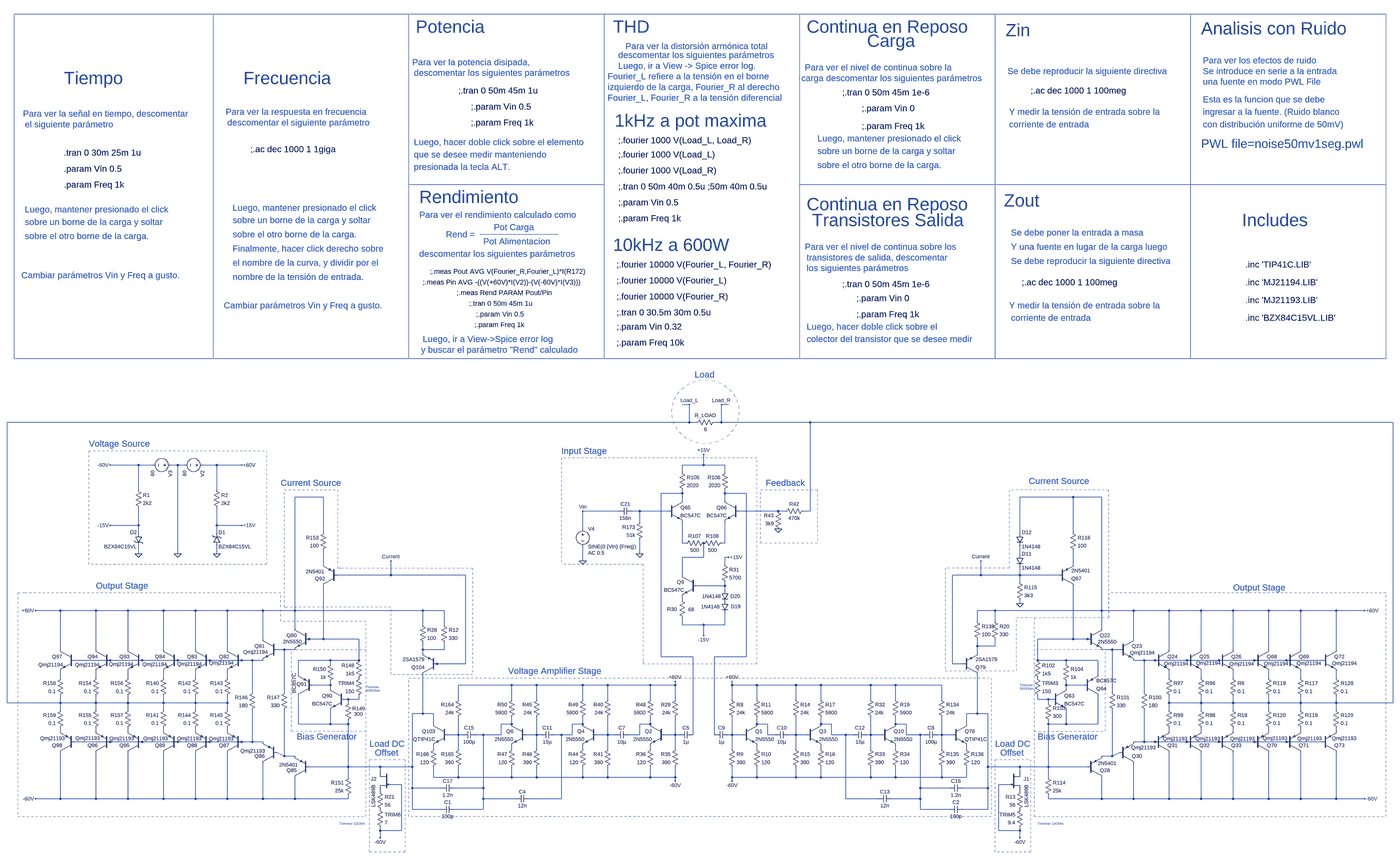
[diagram p0: schematic V12.asc, whole sheet]
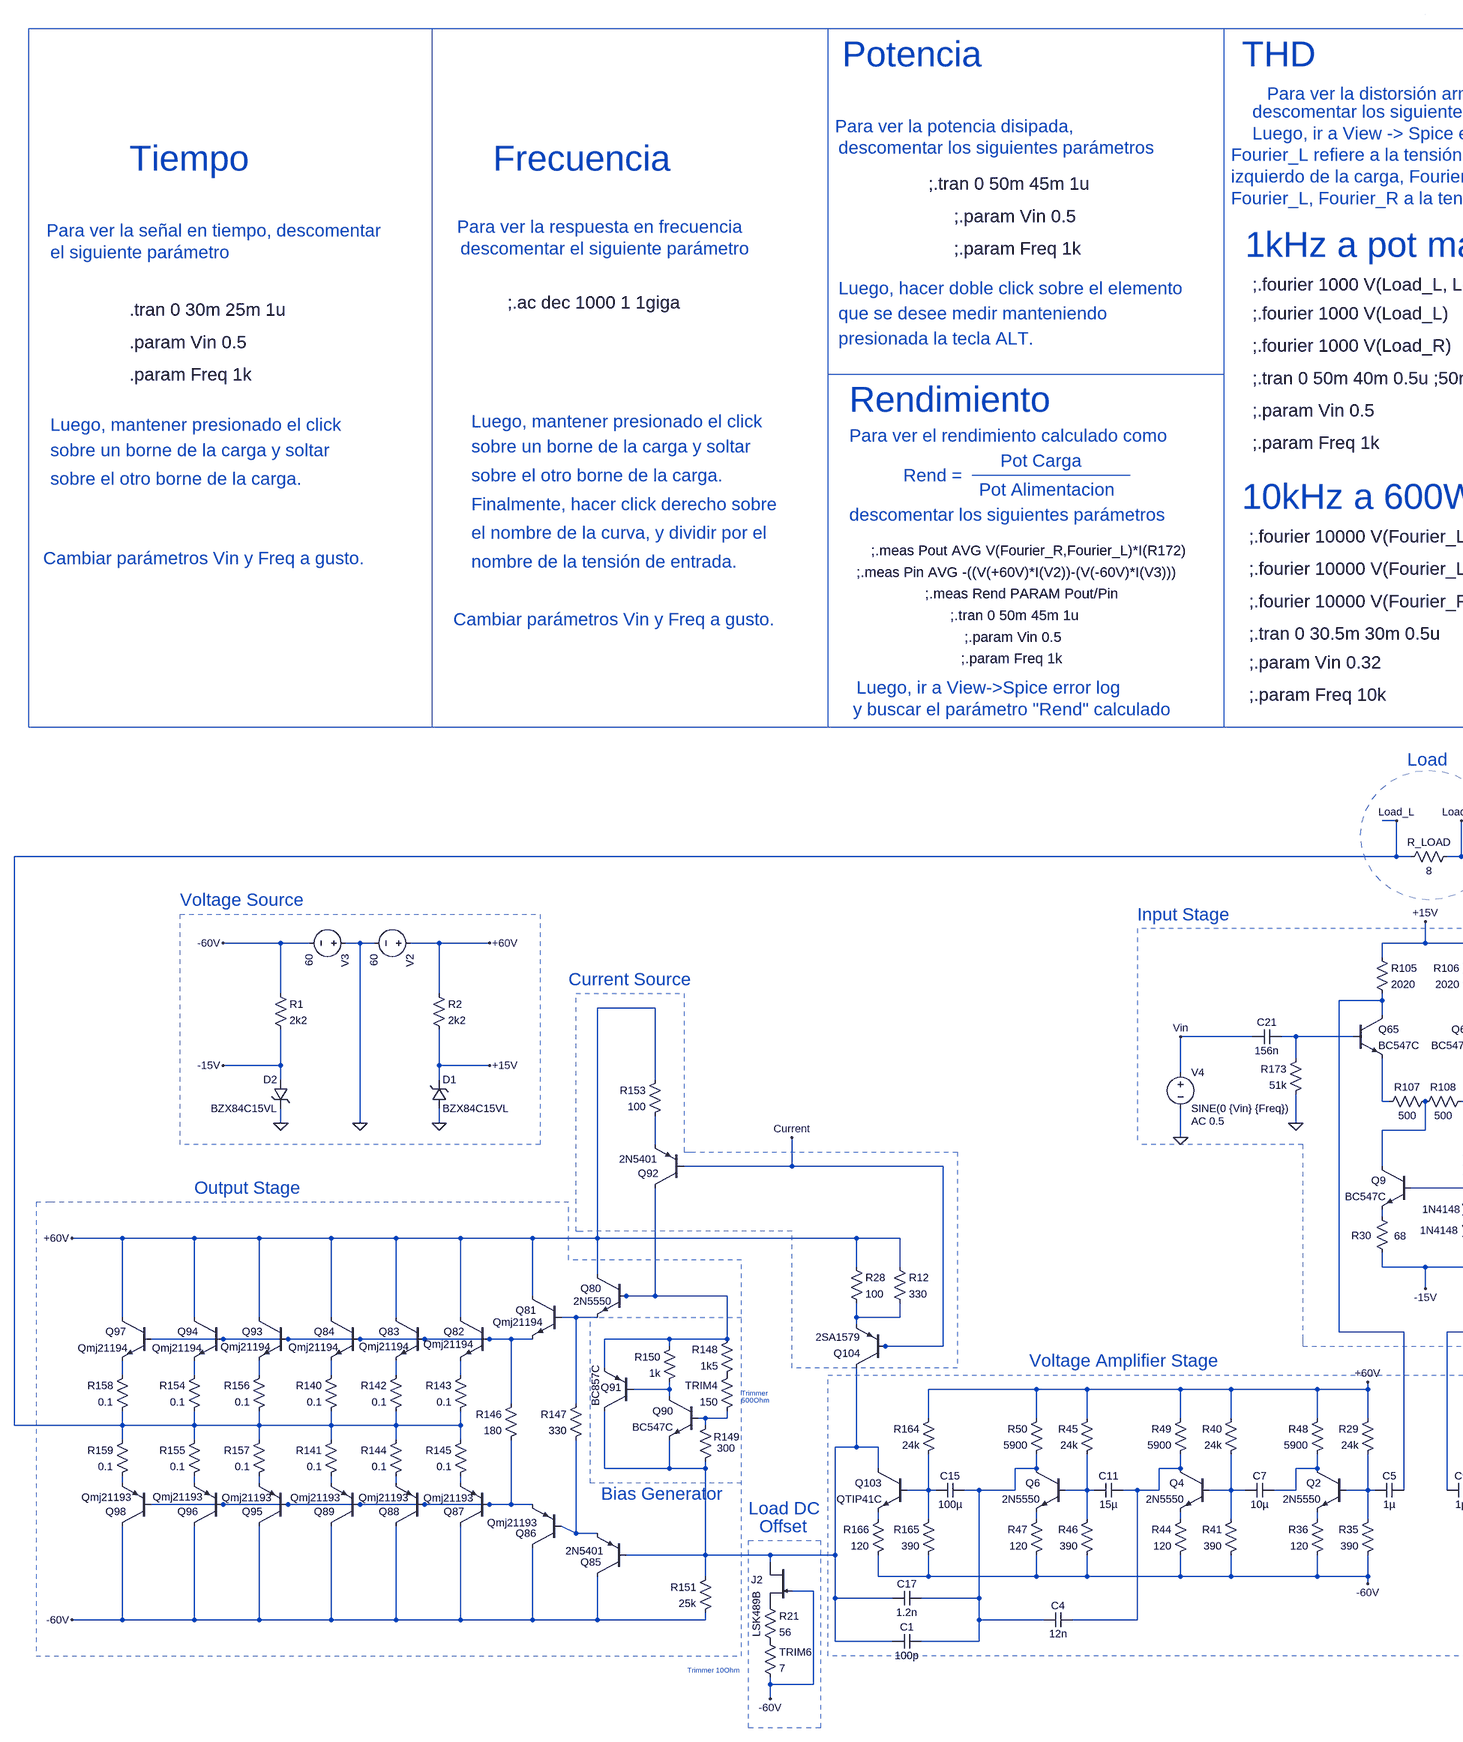
[diagram p1: schematic V12.asc, part, row 1 of 1, column 1 of 2]
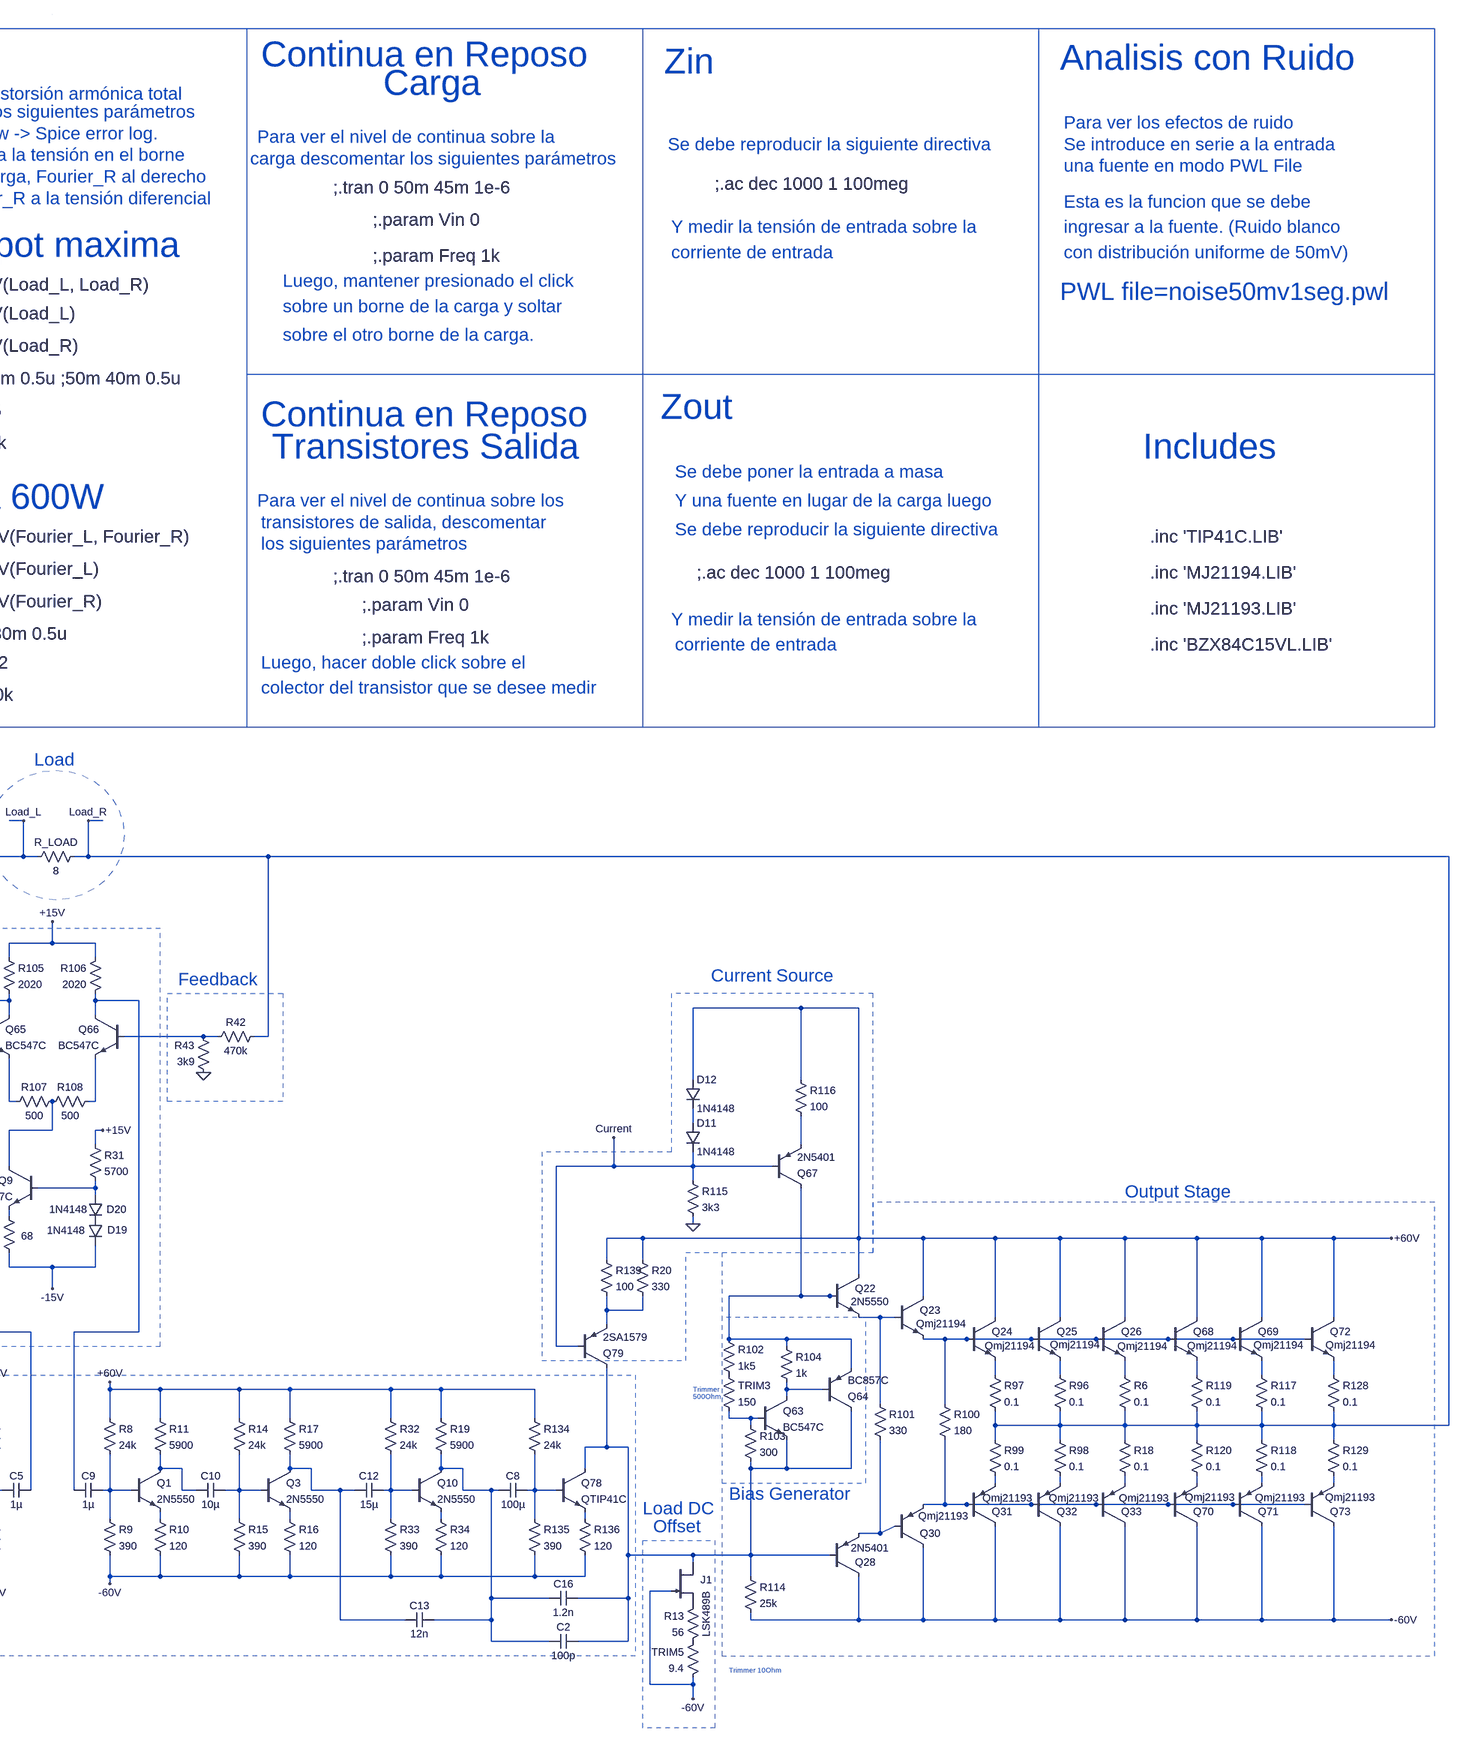
[diagram p2: schematic V12.asc, part, row 1 of 1, column 2 of 2]
V12.asc, the LTspice schematic file:
Version 4
SHEET 1 16980 7664
WIRE 7696 4128 7664 4128
WIRE 7872 4128 7840 4128
WIRE 7696 4208 7696 4128
WIRE 7696 4208 4624 4208
WIRE 7728 4208 7696 4208
WIRE 7840 4208 7840 4128
WIRE 7840 4208 7808 4208
WIRE 8240 4208 7840 4208
WIRE 10864 4208 8240 4208
WIRE 5216 4400 5088 4400
WIRE 5280 4400 5216 4400
WIRE 5392 4400 5360 4400
WIRE 5424 4400 5392 4400
WIRE 5568 4400 5504 4400
WIRE 5680 4400 5568 4400
WIRE 7760 4400 7760 4352
WIRE 7760 4400 7664 4400
WIRE 7856 4400 7760 4400
WIRE 7664 4432 7664 4400
WIRE 7856 4432 7856 4400
WIRE 5216 4512 5216 4400
WIRE 5568 4512 5568 4400
WIRE 7664 4528 7664 4512
WIRE 7664 4528 7568 4528
WIRE 7856 4528 7856 4512
WIRE 7952 4528 7856 4528
WIRE 6048 4544 5920 4544
WIRE 9424 4544 9184 4544
WIRE 9552 4544 9424 4544
WIRE 7664 4560 7664 4528
WIRE 7856 4560 7856 4528
WIRE 7376 4608 7216 4608
WIRE 7472 4608 7440 4608
WIRE 7600 4608 7472 4608
WIRE 8096 4608 7920 4608
WIRE 8128 4608 8096 4608
WIRE 8240 4608 8240 4208
WIRE 8240 4608 8208 4608
WIRE 7472 4656 7472 4608
WIRE 5216 4672 5216 4592
WIRE 5216 4672 5088 4672
WIRE 5568 4672 5568 4592
WIRE 5680 4672 5568 4672
WIRE 7216 4688 7216 4608
WIRE 5216 4704 5216 4672
WIRE 5568 4704 5568 4672
WIRE 6048 4704 6048 4544
WIRE 9184 4704 9184 4544
WIRE 9424 4704 9424 4544
WIRE 7664 4752 7664 4656
WIRE 7680 4752 7664 4752
WIRE 7856 4752 7856 4656
WIRE 7856 4752 7840 4752
WIRE 5216 4800 5216 4768
WIRE 5392 4800 5392 4400
WIRE 5568 4800 5568 4768
WIRE 7472 4800 7472 4736
WIRE 9184 4800 9184 4768
WIRE 7760 4816 7760 4752
WIRE 7760 4816 7664 4816
WIRE 7872 4816 7856 4816
WIRE 7216 4832 7216 4768
WIRE 6048 4848 6048 4784
WIRE 7856 4848 7856 4816
WIRE 9424 4848 9424 4784
WIRE 6352 4896 6352 4832
WIRE 6352 4896 6112 4896
WIRE 6688 4896 6352 4896
WIRE 7664 4896 7664 4816
WIRE 9008 4896 9008 4832
WIRE 9008 4896 8880 4896
WIRE 9184 4896 9184 4864
WIRE 9184 4896 9008 4896
WIRE 9360 4896 9184 4896
WIRE 9184 4928 9184 4896
WIRE 7856 4944 7856 4928
WIRE 7856 4944 7728 4944
WIRE 7856 4960 7856 4944
WIRE 7664 5008 7664 4992
WIRE 7856 5024 7856 5008
WIRE 9184 5024 9184 5008
WIRE 4864 5056 4752 5056
WIRE 5024 5056 4864 5056
WIRE 5168 5056 5024 5056
WIRE 5328 5056 5168 5056
WIRE 5472 5056 5328 5056
WIRE 5616 5056 5472 5056
WIRE 5776 5056 5616 5056
WIRE 5920 5056 5920 4544
WIRE 5920 5056 5776 5056
WIRE 6496 5056 5920 5056
WIRE 6592 5056 6496 5056
WIRE 9072 5056 8992 5056
WIRE 9552 5056 9552 4544
WIRE 9552 5056 9072 5056
WIRE 9696 5056 9552 5056
WIRE 9856 5056 9696 5056
WIRE 10000 5056 9856 5056
WIRE 10144 5056 10000 5056
WIRE 10304 5056 10144 5056
WIRE 10448 5056 10304 5056
WIRE 10608 5056 10448 5056
WIRE 10736 5056 10608 5056
WIRE 8992 5104 8992 5056
WIRE 9072 5104 9072 5056
WIRE 6496 5120 6496 5056
WIRE 6592 5120 6592 5056
WIRE 7664 5120 7664 5088
WIRE 7760 5120 7664 5120
WIRE 7856 5120 7856 5072
WIRE 7856 5120 7760 5120
WIRE 5920 5136 5920 5056
WIRE 9552 5136 9552 5056
WIRE 7760 5168 7760 5120
WIRE 5776 5184 5776 5056
WIRE 5984 5184 5968 5184
WIRE 6048 5184 6048 4944
WIRE 6048 5184 5984 5184
WIRE 6208 5184 6048 5184
WIRE 9424 5184 9424 4944
WIRE 9424 5184 9264 5184
WIRE 9488 5184 9424 5184
WIRE 9504 5184 9488 5184
WIRE 9696 5184 9696 5056
WIRE 8992 5216 8992 5184
WIRE 9072 5216 9072 5184
WIRE 9072 5216 8992 5216
WIRE 4864 5232 4864 5056
WIRE 5024 5232 5024 5056
WIRE 5168 5232 5168 5056
WIRE 5328 5232 5328 5056
WIRE 5472 5232 5472 5056
WIRE 5616 5232 5616 5056
WIRE 5872 5232 5840 5232
WIRE 5920 5232 5872 5232
WIRE 6496 5232 6496 5200
WIRE 6592 5232 6592 5200
WIRE 6592 5232 6496 5232
WIRE 9600 5232 9552 5232
WIRE 9632 5232 9600 5232
WIRE 9856 5232 9856 5056
WIRE 10000 5232 10000 5056
WIRE 10144 5232 10144 5056
WIRE 10304 5232 10304 5056
WIRE 10448 5232 10448 5056
WIRE 10608 5232 10608 5056
WIRE 6496 5248 6496 5232
WIRE 8992 5248 8992 5216
WIRE 7568 5264 7568 4528
WIRE 7712 5264 7568 5264
WIRE 7952 5264 7952 4528
WIRE 7952 5264 7808 5264
WIRE 5088 5280 4928 5280
WIRE 5232 5280 5088 5280
WIRE 5392 5280 5232 5280
WIRE 5536 5280 5392 5280
WIRE 5680 5280 5536 5280
WIRE 5728 5280 5680 5280
WIRE 5776 5280 5728 5280
WIRE 6080 5280 5936 5280
WIRE 6208 5280 6208 5184
WIRE 6208 5280 6080 5280
WIRE 9264 5280 9264 5184
WIRE 9392 5280 9264 5280
WIRE 9536 5280 9392 5280
WIRE 9744 5280 9696 5280
WIRE 9792 5280 9744 5280
WIRE 9936 5280 9792 5280
WIRE 10080 5280 9936 5280
WIRE 10240 5280 10080 5280
WIRE 10384 5280 10240 5280
WIRE 10544 5280 10384 5280
WIRE 6080 5296 6080 5280
WIRE 6560 5296 6544 5296
WIRE 6688 5296 6688 4896
WIRE 6688 5296 6560 5296
WIRE 8880 5296 8880 4896
WIRE 8928 5296 8880 5296
WIRE 9392 5296 9392 5280
WIRE 5936 5344 5936 5280
WIRE 9536 5344 9536 5280
WIRE 4864 5360 4864 5328
WIRE 5024 5360 5024 5328
WIRE 5168 5360 5168 5328
WIRE 5328 5360 5328 5328
WIRE 5472 5360 5472 5328
WIRE 5616 5360 5616 5328
WIRE 9856 5360 9856 5328
WIRE 10000 5360 10000 5328
WIRE 10144 5360 10144 5328
WIRE 10304 5360 10304 5328
WIRE 10448 5360 10448 5328
WIRE 10608 5360 10608 5328
WIRE 6080 5392 6080 5376
WIRE 6080 5392 6000 5392
WIRE 6896 5392 6656 5392
WIRE 7008 5392 6896 5392
WIRE 7216 5392 7008 5392
WIRE 7328 5392 7216 5392
WIRE 7520 5392 7328 5392
WIRE 7632 5392 7632 5376
WIRE 7632 5392 7520 5392
WIRE 7888 5392 7888 5376
WIRE 8000 5392 7888 5392
WIRE 8176 5392 8000 5392
WIRE 8288 5392 8176 5392
WIRE 8512 5392 8288 5392
WIRE 8624 5392 8512 5392
WIRE 8832 5392 8624 5392
WIRE 9392 5392 9392 5376
WIRE 9472 5392 9392 5392
WIRE 6080 5408 6080 5392
WIRE 9392 5408 9392 5392
WIRE 5728 5424 5728 5280
WIRE 5872 5424 5872 5232
WIRE 9600 5424 9600 5232
WIRE 9744 5424 9744 5280
WIRE 6160 5456 6144 5456
WIRE 6208 5456 6208 5440
WIRE 6208 5456 6160 5456
WIRE 6656 5456 6656 5392
WIRE 6896 5456 6896 5392
WIRE 7008 5456 7008 5392
WIRE 7216 5456 7216 5392
WIRE 7328 5456 7328 5392
WIRE 7520 5456 7520 5392
WIRE 7632 5456 7632 5392
WIRE 7888 5456 7888 5392
WIRE 8000 5456 8000 5392
WIRE 8176 5456 8176 5392
WIRE 8288 5456 8288 5392
WIRE 8512 5456 8512 5392
WIRE 8624 5456 8624 5392
WIRE 8832 5456 8832 5392
WIRE 9264 5456 9264 5440
WIRE 9312 5456 9264 5456
WIRE 9328 5456 9312 5456
WIRE 4624 5472 4624 4208
WIRE 4864 5472 4864 5440
WIRE 4864 5472 4624 5472
WIRE 5024 5472 5024 5440
WIRE 5024 5472 4864 5472
WIRE 5168 5472 5168 5440
WIRE 5168 5472 5024 5472
WIRE 5328 5472 5328 5440
WIRE 5328 5472 5168 5472
WIRE 5472 5472 5472 5440
WIRE 5472 5472 5328 5472
WIRE 5616 5472 5616 5440
WIRE 5616 5472 5472 5472
WIRE 6160 5472 6160 5456
WIRE 9312 5472 9312 5456
WIRE 9856 5472 9856 5440
WIRE 10000 5472 10000 5440
WIRE 10000 5472 9856 5472
WIRE 10144 5472 10144 5440
WIRE 10144 5472 10000 5472
WIRE 10304 5472 10304 5440
WIRE 10304 5472 10144 5472
WIRE 10448 5472 10448 5440
WIRE 10448 5472 10304 5472
WIRE 10608 5472 10608 5440
WIRE 10608 5472 10448 5472
WIRE 10864 5472 10864 4208
WIRE 10864 5472 10608 5472
WIRE 4864 5504 4864 5472
WIRE 5024 5504 5024 5472
WIRE 5168 5504 5168 5472
WIRE 5328 5504 5328 5472
WIRE 5472 5504 5472 5472
WIRE 5616 5504 5616 5472
WIRE 9856 5504 9856 5472
WIRE 10000 5504 10000 5472
WIRE 10144 5504 10144 5472
WIRE 10304 5504 10304 5472
WIRE 10448 5504 10448 5472
WIRE 10608 5504 10608 5472
WIRE 6496 5520 6496 5344
WIRE 6496 5520 6448 5520
WIRE 6544 5520 6496 5520
WIRE 8992 5520 8992 5344
WIRE 8992 5520 8944 5520
WIRE 9040 5520 8992 5520
WIRE 5936 5568 5936 5440
WIRE 6080 5568 6080 5504
WIRE 6080 5568 5936 5568
WIRE 6160 5568 6160 5552
WIRE 6160 5568 6080 5568
WIRE 6544 5568 6544 5520
WIRE 6896 5568 6896 5536
WIRE 6896 5568 6848 5568
WIRE 7216 5568 7216 5536
WIRE 7216 5568 7168 5568
WIRE 7520 5568 7520 5536
WIRE 7520 5568 7472 5568
WIRE 8000 5568 8000 5536
WIRE 8048 5568 8000 5568
WIRE 8288 5568 8288 5536
WIRE 8336 5568 8288 5568
WIRE 8624 5568 8624 5536
WIRE 8672 5568 8624 5568
WIRE 8944 5568 8944 5520
WIRE 9312 5568 9312 5552
WIRE 9392 5568 9392 5504
WIRE 9392 5568 9312 5568
WIRE 9536 5568 9536 5440
WIRE 9536 5568 9392 5568
WIRE 4864 5600 4864 5584
WIRE 5024 5600 5024 5584
WIRE 5168 5600 5168 5584
WIRE 5328 5600 5328 5584
WIRE 5472 5600 5472 5584
WIRE 5616 5600 5616 5584
WIRE 9856 5600 9856 5584
WIRE 10000 5600 10000 5584
WIRE 10144 5600 10144 5584
WIRE 10304 5600 10304 5584
WIRE 10448 5600 10448 5584
WIRE 10608 5600 10608 5584
WIRE 6656 5616 6656 5536
WIRE 6656 5616 6608 5616
WIRE 6672 5616 6656 5616
WIRE 6768 5616 6736 5616
WIRE 6848 5616 6848 5568
WIRE 6848 5616 6768 5616
WIRE 7008 5616 7008 5536
WIRE 7008 5616 6960 5616
WIRE 7024 5616 7008 5616
WIRE 7120 5616 7088 5616
WIRE 7168 5616 7168 5568
WIRE 7168 5616 7120 5616
WIRE 7328 5616 7328 5536
WIRE 7328 5616 7280 5616
WIRE 7360 5616 7328 5616
WIRE 7472 5616 7472 5568
WIRE 7472 5616 7424 5616
WIRE 7632 5616 7632 5536
WIRE 7632 5616 7584 5616
WIRE 7648 5616 7632 5616
WIRE 7712 5616 7712 5264
WIRE 7808 5616 7808 5264
WIRE 7888 5616 7888 5536
WIRE 7888 5616 7872 5616
WIRE 7936 5616 7888 5616
WIRE 8048 5616 8048 5568
WIRE 8080 5616 8048 5616
WIRE 8176 5616 8176 5536
WIRE 8176 5616 8144 5616
WIRE 8224 5616 8176 5616
WIRE 8336 5616 8336 5568
WIRE 8400 5616 8336 5616
WIRE 8432 5616 8400 5616
WIRE 8512 5616 8512 5536
WIRE 8512 5616 8496 5616
WIRE 8560 5616 8512 5616
WIRE 8672 5616 8672 5568
WIRE 8736 5616 8672 5616
WIRE 8752 5616 8736 5616
WIRE 8832 5616 8832 5536
WIRE 8832 5616 8816 5616
WIRE 8880 5616 8832 5616
WIRE 5088 5648 4928 5648
WIRE 5232 5648 5088 5648
WIRE 5392 5648 5232 5648
WIRE 5536 5648 5392 5648
WIRE 5680 5648 5536 5648
WIRE 5728 5648 5728 5504
WIRE 5728 5648 5680 5648
WIRE 5776 5648 5728 5648
WIRE 9744 5648 9744 5504
WIRE 9744 5648 9696 5648
WIRE 9792 5648 9744 5648
WIRE 9936 5648 9792 5648
WIRE 10080 5648 9936 5648
WIRE 10240 5648 10080 5648
WIRE 10384 5648 10240 5648
WIRE 10544 5648 10384 5648
WIRE 6544 5680 6544 5664
WIRE 6656 5680 6656 5616
WIRE 6896 5680 6896 5664
WIRE 7008 5680 7008 5616
WIRE 7216 5680 7216 5664
WIRE 7328 5680 7328 5616
WIRE 7520 5680 7520 5664
WIRE 7632 5680 7632 5616
WIRE 7888 5680 7888 5616
WIRE 8000 5680 8000 5664
WIRE 8176 5680 8176 5616
WIRE 8288 5680 8288 5664
WIRE 8512 5680 8512 5616
WIRE 8624 5680 8624 5664
WIRE 8832 5680 8832 5616
WIRE 8944 5680 8944 5664
WIRE 5872 5712 5872 5504
WIRE 5872 5712 5840 5696
WIRE 5920 5712 5872 5712
WIRE 9600 5712 9600 5504
WIRE 9600 5712 9632 5696
WIRE 9600 5712 9552 5712
WIRE 6160 5760 6160 5568
WIRE 6160 5760 5984 5760
WIRE 6304 5760 6160 5760
WIRE 6448 5760 6448 5520
WIRE 6448 5760 6304 5760
WIRE 9040 5760 9040 5520
WIRE 9184 5760 9040 5760
WIRE 9312 5760 9312 5568
WIRE 9312 5760 9184 5760
WIRE 9488 5760 9312 5760
WIRE 6304 5776 6304 5760
WIRE 9184 5776 9184 5760
WIRE 6160 5808 6160 5760
WIRE 6544 5808 6544 5760
WIRE 6656 5808 6656 5760
WIRE 6656 5808 6544 5808
WIRE 6896 5808 6896 5760
WIRE 6896 5808 6656 5808
WIRE 7008 5808 7008 5760
WIRE 7008 5808 6896 5808
WIRE 7216 5808 7216 5760
WIRE 7216 5808 7008 5808
WIRE 7328 5808 7328 5760
WIRE 7328 5808 7216 5808
WIRE 7520 5808 7520 5760
WIRE 7520 5808 7328 5808
WIRE 7632 5808 7632 5760
WIRE 7632 5808 7520 5808
WIRE 7888 5808 7888 5760
WIRE 8000 5808 8000 5760
WIRE 8000 5808 7888 5808
WIRE 8176 5808 8176 5760
WIRE 8176 5808 8000 5808
WIRE 8288 5808 8288 5760
WIRE 8288 5808 8176 5808
WIRE 8512 5808 8512 5760
WIRE 8512 5808 8288 5808
WIRE 8624 5808 8624 5760
WIRE 8624 5808 8512 5808
WIRE 8832 5808 8832 5760
WIRE 8832 5808 8624 5808
WIRE 8944 5808 8944 5760
WIRE 8944 5808 8832 5808
WIRE 9312 5808 9312 5760
WIRE 7632 5824 7632 5808
WIRE 7888 5824 7888 5808
WIRE 6400 5840 6352 5840
WIRE 9136 5840 9088 5840
WIRE 6448 5856 6448 5760
WIRE 6576 5856 6448 5856
WIRE 6768 5856 6768 5616
WIRE 6768 5856 6640 5856
WIRE 8736 5856 8736 5616
WIRE 8864 5856 8736 5856
WIRE 9040 5856 9040 5760
WIRE 9040 5856 8928 5856
WIRE 4864 5904 4864 5696
WIRE 4864 5904 4752 5904
WIRE 5024 5904 5024 5696
WIRE 5024 5904 4864 5904
WIRE 5168 5904 5168 5696
WIRE 5168 5904 5024 5904
WIRE 5328 5904 5328 5696
WIRE 5328 5904 5168 5904
WIRE 5472 5904 5472 5696
WIRE 5472 5904 5328 5904
WIRE 5616 5904 5616 5696
WIRE 5616 5904 5472 5904
WIRE 5776 5904 5776 5744
WIRE 5776 5904 5616 5904
WIRE 5920 5904 5920 5808
WIRE 5920 5904 5776 5904
WIRE 6160 5904 6160 5888
WIRE 6160 5904 5920 5904
WIRE 6768 5904 6768 5856
WIRE 6912 5904 6768 5904
WIRE 7120 5904 7120 5616
WIRE 7120 5904 6976 5904
WIRE 8400 5904 8400 5616
WIRE 8544 5904 8400 5904
WIRE 8736 5904 8736 5856
WIRE 8736 5904 8608 5904
WIRE 9312 5904 9312 5888
WIRE 9552 5904 9552 5808
WIRE 9552 5904 9312 5904
WIRE 9696 5904 9696 5744
WIRE 9696 5904 9552 5904
WIRE 9856 5904 9856 5696
WIRE 9856 5904 9696 5904
WIRE 10000 5904 10000 5696
WIRE 10000 5904 9856 5904
WIRE 10144 5904 10144 5696
WIRE 10144 5904 10000 5904
WIRE 10304 5904 10304 5696
WIRE 10304 5904 10144 5904
WIRE 10448 5904 10448 5696
WIRE 10448 5904 10304 5904
WIRE 10608 5904 10608 5696
WIRE 10608 5904 10448 5904
WIRE 10736 5904 10608 5904
WIRE 6448 5952 6448 5856
WIRE 6576 5952 6448 5952
WIRE 6768 5952 6768 5904
WIRE 6768 5952 6640 5952
WIRE 8736 5952 8736 5904
WIRE 8864 5952 8736 5952
WIRE 9040 5952 9040 5856
WIRE 9040 5952 8928 5952
WIRE 6304 6048 6304 6032
WIRE 6400 6048 6400 5840
WIRE 6400 6048 6304 6048
WIRE 9088 6048 9088 5840
WIRE 9184 6048 9184 6032
WIRE 9184 6048 9088 6048
WIRE 6304 6080 6304 6048
WIRE 9184 6080 9184 6048
FLAG 5392 4800 0
FLAG 5680 4400 +60V
FLAG 5088 4400 -60V
FLAG 7760 4352 +15V
FLAG 9184 5024 0
FLAG 10736 5904 -60V
FLAG 10736 5056 +60V
FLAG 4752 5904 -60V
FLAG 4752 5056 +60V
FLAG 7216 4832 0
FLAG 7472 4800 0
FLAG 5568 4800 0
FLAG 5216 4800 0
FLAG 5680 4672 +15V
FLAG 5088 4672 -15V
FLAG 7696 4128 Load_L
FLAG 7840 4128 Load_R
FLAG 7760 5168 -15V
FLAG 7872 4816 +15V
FLAG 7888 5376 +60V
FLAG 7888 5824 -60V
FLAG 8096 4688 0
FLAG 7632 5376 +60V
FLAG 7632 5824 -60V
FLAG 6352 4832 Current
FLAG 9008 4832 Current
FLAG 9184 6080 -60V
FLAG 6304 6080 -60V
FLAG 7216 4608 Vin
SYMBOL voltage 5520 4400 R90
WINDOW 123 0 0 Left 0
WINDOW 39 24 44 Left 2
SYMATTR InstName V2
SYMATTR Value 60
SYMBOL voltage 5376 4400 R90
WINDOW 123 0 0 Left 0
WINDOW 39 24 124 Left 2
SYMATTR InstName V3
SYMATTR Value 60
SYMBOL npn 9488 5136 R0
WINDOW 3 47 61 Left 2
SYMATTR Value 2N5550
SYMATTR InstName Q22
SYMBOL npn 9632 5184 R0
WINDOW 3 48 62 Left 2
SYMATTR Value Qmj21194
SYMATTR InstName Q23
SYMBOL npn 9792 5232 R0
WINDOW 3 40 63 Left 2
SYMATTR Value Qmj21194
SYMATTR InstName Q24
SYMBOL npn 9936 5232 R0
WINDOW 3 41 61 Left 2
SYMATTR Value Qmj21194
SYMATTR InstName Q25
SYMBOL npn 10080 5232 R0
WINDOW 3 47 64 Left 2
SYMATTR Value Qmj21194
SYMATTR InstName Q26
SYMBOL pnp 9488 5808 M180
WINDOW 3 47 64 Left 2
SYMATTR Value 2N5401
SYMATTR InstName Q28
SYMBOL pnp 9632 5744 M180
WINDOW 3 53 70 Left 2
SYMATTR Value Qmj21193
SYMATTR InstName Q30
SYMBOL pnp 9792 5696 M180
WINDOW 3 35 62 Left 2
SYMATTR Value Qmj21193
SYMATTR InstName Q31
SYMBOL pnp 9936 5696 M180
WINDOW 3 39 62 Left 2
SYMATTR Value Qmj21193
SYMATTR InstName Q32
SYMBOL pnp 10080 5696 M180
WINDOW 3 51 62 Left 2
SYMATTR Value Qmj21193
SYMATTR InstName Q33
SYMBOL res 10128 5344 R0
SYMATTR InstName R6
SYMATTR Value 0.1
SYMBOL res 10128 5488 R0
SYMATTR InstName R18
SYMATTR Value 0.1
SYMBOL res 9984 5344 R0
SYMATTR InstName R96
SYMATTR Value 0.1
SYMBOL res 9840 5344 R0
SYMATTR InstName R97
SYMATTR Value 0.1
SYMBOL res 9984 5488 R0
SYMATTR InstName R98
SYMATTR Value 0.1
SYMBOL res 9840 5488 R0
SYMATTR InstName R99
SYMATTR Value 0.1
SYMBOL res 9728 5408 R0
SYMATTR InstName R100
SYMATTR Value 180
SYMBOL res 9584 5408 R0
SYMATTR InstName R101
SYMATTR Value 330
SYMBOL npn 9328 5408 R0
SYMATTR InstName Q63
SYMATTR Value BC547C
SYMBOL res 9248 5264 R0
SYMATTR InstName R102
SYMATTR Value 1k5
SYMBOL res 9296 5456 R0
SYMATTR InstName R103
SYMATTR Value 300
SYMBOL res 9376 5280 R0
SYMATTR InstName R104
SYMATTR Value 1k
SYMBOL pnp 9472 5440 M180
SYMATTR InstName Q64
SYMATTR Value BC857C
SYMBOL npn 7600 4560 R0
SYMATTR InstName Q65
SYMATTR Value BC547C
SYMBOL npn 7920 4560 M0
SYMATTR InstName Q66
SYMATTR Value BC547C
SYMBOL res 7648 4416 R0
SYMATTR InstName R105
SYMATTR Value 2020
SYMBOL res 7872 4416 M0
SYMATTR InstName R106
SYMATTR Value 2020
SYMBOL res 7776 4736 R90
WINDOW 0 0 56 VBottom 2
WINDOW 3 32 56 VTop 2
SYMATTR InstName R107
SYMATTR Value 500
SYMBOL res 7856 4736 R90
WINDOW 0 0 56 VBottom 2
WINDOW 3 32 56 VTop 2
SYMATTR InstName R108
SYMATTR Value 500
SYMBOL res 9296 5792 R0
SYMATTR InstName R114
SYMATTR Value 25k
SYMBOL pnp 9360 4944 M180
SYMATTR InstName Q67
SYMATTR Value 2N5401
SYMBOL res 9168 4912 R0
SYMATTR InstName R115
SYMATTR Value 3k3
SYMBOL diode 9168 4800 R0
SYMATTR InstName D11
SYMATTR Value 1N4148
SYMBOL diode 9168 4704 R0
SYMATTR InstName D12
SYMATTR Value 1N4148
SYMBOL res 9408 4688 R0
SYMATTR InstName R116
SYMATTR Value 100
SYMBOL npn 10240 5232 R0
WINDOW 3 42 63 Left 2
SYMATTR Value Qmj21194
SYMATTR InstName Q68
SYMBOL npn 10384 5232 R0
WINDOW 3 46 62 Left 2
SYMATTR Value Qmj21194
SYMATTR InstName Q69
SYMBOL pnp 10240 5696 M180
WINDOW 3 37 64 Left 2
SYMATTR Value Qmj21193
SYMATTR InstName Q70
SYMBOL pnp 10384 5696 M180
WINDOW 3 49 63 Left 2
SYMATTR Value Qmj21193
SYMATTR InstName Q71
SYMBOL res 10432 5344 R0
SYMATTR InstName R117
SYMATTR Value 0.1
SYMBOL res 10432 5488 R0
SYMATTR InstName R118
SYMATTR Value 0.1
SYMBOL res 10288 5344 R0
SYMATTR InstName R119
SYMATTR Value 0.1
SYMBOL res 10288 5488 R0
SYMATTR InstName R120
SYMATTR Value 0.1
SYMBOL npn 10544 5232 R0
WINDOW 3 46 62 Left 2
SYMATTR Value Qmj21194
SYMATTR InstName Q72
SYMBOL pnp 10544 5696 M180
WINDOW 3 45 64 Left 2
SYMATTR Value Qmj21193
SYMATTR InstName Q73
SYMBOL res 10592 5344 R0
SYMATTR InstName R128
SYMATTR Value 0.1
SYMBOL res 10592 5488 R0
SYMATTR InstName R129
SYMATTR Value 0.1
SYMBOL res 8816 5440 R0
SYMATTR InstName R134
SYMATTR Value 24k
SYMBOL res 8816 5664 R0
SYMATTR InstName R135
SYMATTR Value 390
SYMBOL npn 8880 5568 R0
SYMATTR InstName Q78
SYMATTR Value QTIP41C
SYMBOL res 8928 5664 R0
SYMATTR InstName R136
SYMATTR Value 120
SYMBOL pnp 8928 5344 M180
SYMATTR InstName Q79
SYMATTR Value 2SA1579
SYMBOL res 8976 5088 R0
SYMATTR InstName R139
SYMATTR Value 100
SYMBOL cap 8928 5840 R90
WINDOW 0 0 32 VBottom 2
WINDOW 3 32 32 VTop 2
SYMATTR InstName C16
SYMATTR Value 1.2n
SYMATTR SpiceLine Rser=0.1
SYMBOL npn 5984 5136 M0
WINDOW 3 33 60 Left 2
SYMATTR Value 2N5550
SYMATTR InstName Q80
SYMBOL npn 5840 5184 M0
WINDOW 3 41 59 Left 2
SYMATTR Value Qmj21194
SYMATTR InstName Q81
SYMBOL npn 5680 5232 M0
WINDOW 3 35 60 Left 2
SYMATTR Value Qmj21194
SYMATTR InstName Q82
SYMBOL npn 5536 5232 M0
WINDOW 3 34 65 Left 2
SYMATTR Value Qmj21194
SYMATTR InstName Q83
SYMBOL npn 5392 5232 M0
WINDOW 3 47 67 Left 2
SYMATTR Value Qmj21194
SYMATTR InstName Q84
SYMBOL pnp 5984 5808 R180
WINDOW 3 50 57 Left 2
SYMATTR Value 2N5401
SYMATTR InstName Q85
SYMBOL pnp 5840 5744 R180
WINDOW 3 53 55 Left 2
SYMATTR Value Qmj21193
SYMATTR InstName Q86
SYMBOL pnp 5680 5696 R180
WINDOW 3 35 62 Left 2
SYMATTR Value Qmj21193
SYMATTR InstName Q87
SYMBOL pnp 5536 5696 R180
WINDOW 3 35 63 Left 2
SYMATTR Value Qmj21193
SYMATTR InstName Q88
SYMBOL pnp 5392 5696 R180
WINDOW 3 43 63 Left 2
SYMATTR Value Qmj21193
SYMATTR InstName Q89
SYMBOL res 5344 5344 M0
SYMATTR InstName R140
SYMATTR Value 0.1
SYMBOL res 5344 5488 M0
SYMATTR InstName R141
SYMATTR Value 0.1
SYMBOL res 5488 5344 M0
SYMATTR InstName R142
SYMATTR Value 0.1
SYMBOL res 5632 5344 M0
SYMATTR InstName R143
SYMATTR Value 0.1
SYMBOL res 5488 5488 M0
SYMATTR InstName R144
SYMATTR Value 0.1
SYMBOL res 5632 5488 M0
SYMATTR InstName R145
SYMATTR Value 0.1
SYMBOL res 5744 5408 M0
SYMATTR InstName R146
SYMATTR Value 180
SYMBOL res 5888 5408 M0
SYMATTR InstName R147
SYMATTR Value 330
SYMBOL npn 6144 5408 M0
SYMATTR InstName Q90
SYMATTR Value BC547C
SYMBOL res 6224 5264 M0
SYMATTR InstName R148
SYMATTR Value 1k5
SYMBOL res 6176 5456 M0
WINDOW 0 -60 42 Left 2
WINDOW 3 -50 67 Left 2
SYMATTR InstName R149
SYMATTR Value 300
SYMBOL res 6096 5280 M0
SYMATTR InstName R150
SYMATTR Value 1k
SYMBOL pnp 6000 5440 R180
WINDOW 0 27 52 Left 2
WINDOW 3 84 11 VRight 2
SYMATTR InstName Q91
SYMATTR Value BC857C
SYMBOL res 6176 5792 M0
SYMATTR InstName R151
SYMATTR Value 25k
SYMBOL pnp 6112 4944 R180
WINDOW 3 59 64 Left 2
SYMATTR Value 2N5401
SYMATTR InstName Q92
SYMBOL res 6064 4688 M0
SYMATTR InstName R153
SYMATTR Value 100
SYMBOL npn 5232 5232 M0
WINDOW 3 38 66 Left 2
SYMATTR Value Qmj21194
SYMATTR InstName Q93
SYMBOL npn 5088 5232 M0
WINDOW 3 46 68 Left 2
SYMATTR Value Qmj21194
SYMATTR InstName Q94
SYMBOL pnp 5232 5696 R180
WINDOW 3 35 63 Left 2
SYMATTR Value Qmj21193
SYMATTR InstName Q95
SYMBOL pnp 5088 5696 R180
WINDOW 3 45 65 Left 2
SYMATTR Value Qmj21193
SYMATTR InstName Q96
SYMBOL res 5040 5344 M0
SYMATTR InstName R154
SYMATTR Value 0.1
SYMBOL res 5040 5488 M0
SYMATTR InstName R155
SYMATTR Value 0.1
SYMBOL res 5184 5344 M0
SYMATTR InstName R156
SYMATTR Value 0.1
SYMBOL res 5184 5488 M0
SYMATTR InstName R157
SYMATTR Value 0.1
SYMBOL npn 4928 5232 M0
WINDOW 3 51 68 Left 2
SYMATTR Value Qmj21194
SYMATTR InstName Q97
SYMBOL pnp 4928 5696 R180
WINDOW 3 43 64 Left 2
SYMATTR Value Qmj21193
SYMATTR InstName Q98
SYMBOL res 4880 5344 M0
SYMATTR InstName R158
SYMATTR Value 0.1
SYMBOL res 4880 5488 M0
SYMATTR InstName R159
SYMATTR Value 0.1
SYMBOL res 6672 5440 M0
SYMATTR InstName R164
SYMATTR Value 24k
SYMBOL res 6672 5664 M0
SYMATTR InstName R165
SYMATTR Value 390
SYMBOL npn 6608 5568 M0
SYMATTR InstName Q103
SYMATTR Value QTIP41C
SYMBOL res 6560 5664 M0
SYMATTR InstName R166
SYMATTR Value 120
SYMBOL pnp 6560 5344 R180
SYMATTR InstName Q104
SYMATTR Value 2SA1579
SYMBOL cap 6576 5840 M90
WINDOW 0 0 32 VBottom 2
WINDOW 3 32 32 VTop 2
SYMATTR InstName C17
SYMATTR Value 1.2n
SYMATTR SpiceLine Rser=0.1
SYMBOL voltage 7216 4672 R0
WINDOW 123 24 124 Left 2
WINDOW 39 0 0 Left 0
SYMATTR Value2 AC 0.5
SYMATTR InstName V4
SYMATTR Value SINE(0 {Vin} {Freq})
SYMBOL cap 7440 4592 R90
WINDOW 0 0 32 VBottom 2
WINDOW 3 32 32 VTop 2
SYMATTR InstName C21
SYMATTR Value 156n
SYMATTR SpiceLine Rser=0.1
SYMBOL res 7488 4640 M0
SYMATTR InstName R173
SYMATTR Value 51k
SYMBOL res 7824 4192 R90
WINDOW 0 0 56 VBottom 2
WINDOW 3 32 56 VTop 2
SYMATTR InstName R_LOAD
SYMATTR Value 8
SYMBOL zener 5552 4768 M180
WINDOW 0 24 64 Left 2
WINDOW 3 24 0 Left 2
SYMATTR InstName D1
SYMATTR Value BZX84C15VL
SYMBOL zener 5232 4704 M0
SYMATTR InstName D2
SYMATTR Value BZX84C15VL
SYMBOL diode 7872 5008 M0
WINDOW 0 -55 30 Left 2
WINDOW 3 39 31 Left 2
SYMATTR InstName D19
SYMATTR Value 1N4148
SYMBOL diode 7872 4960 M0
WINDOW 0 -53 32 Left 2
WINDOW 3 34 32 Left 2
SYMATTR InstName D20
SYMATTR Value 1N4148
SYMBOL npn 7728 4896 M0
SYMATTR InstName Q9
SYMATTR Value BC547C
SYMBOL res 7648 4992 R0
WINDOW 0 -52 58 Left 2
WINDOW 3 43 59 Left 2
SYMATTR InstName R30
SYMATTR Value 68
SYMBOL res 7840 4832 R0
SYMATTR InstName R31
SYMATTR Value 5700
SYMBOL res 7872 5440 R0
SYMATTR InstName R8
SYMATTR Value 24k
SYMBOL res 7872 5664 R0
SYMATTR InstName R9
SYMATTR Value 390
SYMBOL npn 7936 5568 R0
SYMATTR InstName Q1
SYMATTR Value 2N5550
SYMBOL res 7984 5664 R0
SYMATTR InstName R10
SYMATTR Value 120
SYMBOL res 8160 5440 R0
SYMATTR InstName R14
SYMATTR Value 24k
SYMBOL res 8160 5664 R0
SYMATTR InstName R15
SYMATTR Value 390
SYMBOL npn 8224 5568 R0
SYMATTR InstName Q3
SYMATTR Value 2N5550
SYMBOL res 8272 5664 R0
SYMATTR InstName R16
SYMATTR Value 120
SYMBOL res 8496 5440 R0
SYMATTR InstName R32
SYMATTR Value 24k
SYMBOL res 8496 5664 R0
SYMATTR InstName R33
SYMATTR Value 390
SYMBOL npn 8560 5568 R0
SYMATTR InstName Q10
SYMATTR Value 2N5550
SYMBOL res 8608 5664 R0
SYMATTR InstName R34
SYMATTR Value 120
SYMBOL res 8224 4592 R90
WINDOW 0 0 56 VBottom 2
WINDOW 3 32 56 VTop 2
SYMATTR InstName R42
SYMATTR Value 470k
SYMBOL res 8112 4704 R180
WINDOW 0 36 76 Left 2
WINDOW 3 36 40 Left 2
SYMATTR InstName R43
SYMATTR Value 3k9
SYMBOL res 7984 5440 R0
SYMATTR InstName R11
SYMATTR Value 5900
SYMBOL res 8272 5440 R0
SYMATTR InstName R17
SYMATTR Value 5900
SYMBOL res 8608 5440 R0
SYMATTR InstName R19
SYMATTR Value 5900
SYMBOL res 6480 5104 R0
SYMATTR InstName R28
SYMATTR Value 100
SYMBOL cap 8544 5888 M90
WINDOW 0 0 32 VBottom 2
WINDOW 3 32 32 VTop 2
SYMATTR InstName C13
SYMATTR Value 12n
SYMATTR SpiceLine Rser=0.1
SYMBOL cap 8752 5600 M90
WINDOW 0 0 32 VBottom 2
WINDOW 3 32 32 VTop 2
SYMATTR InstName C8
SYMATTR Value 100µ
SYMATTR SpiceLine Rser=0.1
SYMBOL cap 6672 5600 M90
WINDOW 0 0 32 VBottom 2
WINDOW 3 32 32 VTop 2
SYMATTR InstName C15
SYMATTR Value 100µ
SYMATTR SpiceLine Rser=0.1
SYMBOL cap 7872 5600 R90
WINDOW 0 0 32 VBottom 2
WINDOW 3 32 32 VTop 2
SYMATTR InstName C9
SYMATTR Value 1µ
SYMBOL cap 8144 5600 R90
WINDOW 0 0 32 VBottom 2
WINDOW 3 32 32 VTop 2
SYMATTR InstName C10
SYMATTR Value 10µ
SYMBOL cap 8496 5600 R90
WINDOW 0 0 32 VBottom 2
WINDOW 3 32 32 VTop 2
SYMATTR InstName C12
SYMATTR Value 15µ
SYMBOL res 7648 5440 M0
SYMATTR InstName R29
SYMATTR Value 24k
SYMBOL res 7648 5664 M0
SYMATTR InstName R35
SYMATTR Value 390
SYMBOL npn 7584 5568 M0
SYMATTR InstName Q2
SYMATTR Value 2N5550
SYMBOL res 7536 5664 M0
SYMATTR InstName R36
SYMATTR Value 120
SYMBOL res 7344 5440 M0
SYMATTR InstName R40
SYMATTR Value 24k
SYMBOL res 7344 5664 M0
SYMATTR InstName R41
SYMATTR Value 390
SYMBOL npn 7280 5568 M0
SYMATTR InstName Q4
SYMATTR Value 2N5550
SYMBOL res 7232 5664 M0
SYMATTR InstName R44
SYMATTR Value 120
SYMBOL res 7024 5440 M0
SYMATTR InstName R45
SYMATTR Value 24k
SYMBOL res 7024 5664 M0
SYMATTR InstName R46
SYMATTR Value 390
SYMBOL npn 6960 5568 M0
SYMATTR InstName Q6
SYMATTR Value 2N5550
SYMBOL res 6912 5664 M0
SYMATTR InstName R47
SYMATTR Value 120
SYMBOL res 7536 5440 M0
SYMATTR InstName R48
SYMATTR Value 5900
SYMBOL res 7232 5440 M0
SYMATTR InstName R49
SYMATTR Value 5900
SYMBOL res 6912 5440 M0
SYMATTR InstName R50
SYMATTR Value 5900
SYMBOL cap 6976 5888 R90
WINDOW 0 0 32 VBottom 2
WINDOW 3 32 32 VTop 2
SYMATTR InstName C4
SYMATTR Value 12n
SYMATTR SpiceLine Rser=0.1
SYMBOL cap 7648 5600 M90
WINDOW 0 0 32 VBottom 2
WINDOW 3 32 32 VTop 2
SYMATTR InstName C5
SYMATTR Value 1µ
SYMBOL cap 7360 5600 M90
WINDOW 0 0 32 VBottom 2
WINDOW 3 32 32 VTop 2
SYMATTR InstName C7
SYMATTR Value 10µ
SYMBOL cap 7024 5600 M90
WINDOW 0 0 32 VBottom 2
WINDOW 3 32 32 VTop 2
SYMATTR InstName C11
SYMATTR Value 15µ
SYMBOL res 6576 5104 R0
SYMATTR InstName R12
SYMATTR Value 330
SYMBOL res 9056 5088 R0
SYMATTR InstName R20
SYMATTR Value 330
SYMBOL res 6224 5344 M0
SYMATTR InstName TRIM4
SYMATTR Value 150
SYMBOL res 9248 5344 R0
SYMATTR InstName TRIM3
SYMATTR Value 150
SYMBOL njf 9136 5776 R0
WINDOW 0 65 39 Left 2
WINDOW 3 78 65 VRight 2
SYMATTR InstName J1
SYMATTR Value LSK489B
SYMBOL res 9200 5856 M0
SYMATTR InstName R13
SYMATTR Value 56
SYMBOL res 9200 5936 M0
SYMATTR InstName TRIM5
SYMATTR Value 9.4
SYMBOL njf 6352 5776 M0
WINDOW 0 65 39 Left 2
WINDOW 3 78 65 VRight 2
SYMATTR InstName J2
SYMATTR Value LSK489B
SYMBOL res 6288 5856 R0
SYMATTR InstName R21
SYMATTR Value 56
SYMBOL res 6288 5936 R0
SYMATTR InstName TRIM6
SYMATTR Value 7
SYMBOL res 5200 4496 R0
SYMATTR InstName R1
SYMATTR Value 2k2
SYMBOL res 5552 4496 R0
SYMATTR InstName R2
SYMATTR Value 2k2
SYMBOL cap 6640 5936 R90
WINDOW 0 0 32 VBottom 2
WINDOW 3 32 32 VTop 2
SYMATTR InstName C1
SYMATTR Value 100p
SYMBOL cap 8928 5936 R90
WINDOW 0 0 32 VBottom 2
WINDOW 3 32 32 VTop 2
SYMATTR InstName C2
SYMATTR Value 100p
TEXT 10200 3496 Left 4 !.inc 'TIP41C.LIB'
TEXT 10200 3576 Left 4 !.inc 'MJ21194.LIB'
TEXT 10200 3656 Left 4 !.inc 'MJ21193.LIB'
TEXT 10200 3736 Left 4 !.inc 'BZX84C15VL.LIB'
TEXT 6656 2712 Left 4 !;.tran 0 50m 45m 1u
TEXT 5720 2976 Left 4 !;.ac dec 1000 1 1giga
TEXT 7376 2936 Left 4 !;.fourier 1000 V(Load_L, Load_R)
TEXT 7376 3000 Left 4 !;.fourier 1000 V(Load_L)
TEXT 7376 3072 Left 4 !;.fourier 1000 V(Load_R)
TEXT 4992 4304 Left 4 ;Voltage Source
TEXT 6880 5328 Left 4 ;Voltage Amplifier Stage
TEXT 7120 4336 Left 4 ;Input Stage
TEXT 8040 4480 Left 4 ;Feedback
TEXT 10144 4952 Left 4 ;Output Stage
TEXT 5024 4944 Left 4 ;Output Stage
TEXT 7720 3992 Left 4 ;Load
TEXT 9072 5656 Left 4 ;Load DC
TEXT 9224 4472 Left 4 ;Current Source
TEXT 5856 4480 Left 4 ;Current Source
TEXT 9264 5624 Left 4 ;Bias Generator
TEXT 5928 5624 Left 4 ;Bias Generator
TEXT 4880 2656 Left 6 ;Tiempo
TEXT 9096 5696 Left 4 ;Offset
TEXT 6256 5656 Left 4 ;Load DC
TEXT 6280 5696 Left 4 ;Offset
TEXT 5688 2656 Left 6 ;Frecuencia
TEXT 6464 2424 Left 6 ;Potencia
TEXT 7352 2424 Left 6 ;THD
TEXT 8224 2424 Left 6 ;Continua en Reposo
TEXT 10184 3296 Left 6 ;Includes
TEXT 8224 3224 Left 6 ;Continua en Reposo
TEXT 8496 2488 Left 6 ;Carga
TEXT 8248 3296 Left 6 ;Transistores Salida
TEXT 7408 2512 Left 4 ;Para ver la distorsión armónica total
TEXT 7376 2552 Left 4 ;descomentar los siguientes parámetros
TEXT 7376 2600 Left 4 ;Luego, ir a View -> Spice error log.
TEXT 7328 2648 Left 4 ;Fourier_L refiere a la tensión en el borne
TEXT 7328 2696 Left 4 ;izquierdo de la carga, Fourier_R al derecho
TEXT 7328 2744 Left 4 ;Fourier_L, Fourier_R a la tensión diferencial
TEXT 6448 2584 Left 4 ;Para ver la potencia disipada,
TEXT 6456 2632 Left 4 ;descomentar los siguientes parámetros
TEXT 7376 3144 Left 4 !;.tran 0 50m 40m 0.5u ;50m 40m 0.5u
TEXT 6456 2944 Left 4 ;Luego, hacer doble click sobre el elemento
TEXT 6456 3000 Left 4 ;que se desee medir manteniendo
TEXT 5608 2808 Left 4 ;Para ver la respuesta en frecuencia
TEXT 5616 2856 Left 4 ;descomentar el siguiente parámetro
TEXT 5640 3240 Left 4 ;Luego, mantener presionado el click
TEXT 5640 3296 Left 4 ;sobre un borne de la carga y soltar
TEXT 5640 3360 Left 4 ;sobre el otro borne de la carga.
TEXT 5640 3424 Left 4 ;Finalmente, hacer click derecho sobre
TEXT 5640 3488 Left 4 ;el nombre de la curva, y dividir por el
TEXT 5640 3552 Left 4 ;nombre de la tensión de entrada.
TEXT 8384 2720 Left 4 !;.tran 0 50m 45m 1e-6
TEXT 8216 2608 Left 4 ;Para ver el nivel de continua sobre la
TEXT 8200 2656 Left 4 ;carga descomentar los siguientes parámetros
TEXT 8272 2928 Left 4 ;Luego, mantener presionado el click
TEXT 8272 2984 Left 4 ;sobre un borne de la carga y soltar
TEXT 8272 3048 Left 4 ;sobre el otro borne de la carga.
TEXT 8384 3584 Left 4 !;.tran 0 50m 45m 1e-6
TEXT 8216 3416 Left 4 ;Para ver el nivel de continua sobre los
TEXT 8224 3464 Left 4 ;transistores de salida, descomentar
TEXT 8224 3776 Left 4 ;Luego, hacer doble click sobre el
TEXT 8224 3832 Left 4 ;colector del transistor que se desee medir
TEXT 8224 3512 Left 4 ;los siguientes parámetros
TEXT 4880 2992 Left 4 !.tran 0 30m 25m 1u
TEXT 4696 2816 Left 4 ;Para ver la señal en tiempo, descomentar
TEXT 4704 2864 Left 4 ;el siguiente parámetro
TEXT 4704 3248 Left 4 ;Luego, mantener presionado el click
TEXT 4704 3304 Left 4 ;sobre un borne de la carga y soltar
TEXT 4704 3368 Left 4 ;sobre el otro borne de la carga.
TEXT 6480 3192 Left 6 ;Rendimiento
TEXT 6456 3056 Left 4 ;presionada la tecla ALT.
TEXT 6240 5400 Left 1 ;Trimmer
TEXT 6120 6016 Left 1 ;Trimmer 10Ohm
TEXT 9264 6016 Left 1 ;Trimmer 10Ohm
TEXT 6240 5416 Left 1 ;500Ohm
TEXT 9184 5392 Left 1 ;Trimmer
TEXT 9184 5408 Left 1 ;500Ohm
TEXT 10000 2432 Left 6 ;Analisis con Ruido
TEXT 10008 2576 Left 4 ;Para ver los efectos de ruido
TEXT 10008 2624 Left 4 ;Se introduce en serie a la entrada
TEXT 10008 2672 Left 4 ;una fuente en modo PWL File
TEXT 10008 2752 Left 4 ;Esta es la funcion que se debe
TEXT 10000 2952 Left 5 ;PWL file=noise50mv1seg.pwl
TEXT 9120 2440 Left 6 ;Zin
TEXT 9128 2624 Left 4 ;Se debe reproducir la siguiente directiva
TEXT 9232 2712 Left 4 !;.ac dec 1000 1 100meg
TEXT 9136 2808 Left 4 ;Y medir la tensión de entrada sobre la
TEXT 9136 2864 Left 4 ;corriente de entrada
TEXT 9144 3352 Left 4 ;Se debe poner la entrada a masa
TEXT 9192 3576 Left 4 !;.ac dec 1000 1 100meg
TEXT 9136 3680 Left 4 ;Y medir la tensión de entrada sobre la
TEXT 9144 3736 Left 4 ;corriente de entrada
TEXT 9112 3208 Left 6 ;Zout
TEXT 9144 3416 Left 4 ;Y una fuente en lugar de la carga luego
TEXT 9144 3480 Left 4 ;Se debe reproducir la siguiente directiva
TEXT 6528 3528 Left 3 !;.meas Pout AVG V(Fourier_R,Fourier_L)*I(R172)
TEXT 6496 3576 Left 3 !;.meas Pin AVG -((V(+60V)*I(V2))-(V(-60V)*I(V3)))
TEXT 6648 3624 Left 3 !;.meas Rend PARAM Pout/Pin
TEXT 6480 3272 Left 4 ;Para ver el rendimiento calculado como
TEXT 6816 3328 Left 4 ;Pot Carga
TEXT 6480 3448 Left 4 ;descomentar los siguientes parámetros
TEXT 6496 3832 Left 4 ;Luego, ir a View->Spice error log
TEXT 6488 3880 Left 4 ;y buscar el parámetro "Rend" calculado
TEXT 10008 2808 Left 4 ;ingresar a la fuente. (Ruido blanco
TEXT 10008 2864 Left 4 ;con distribución uniforme de 50mV)
TEXT 7360 2848 Left 6 ;1kHz a pot maxima
TEXT 7368 3496 Left 4 !;.fourier 10000 V(Fourier_L, Fourier_R)
TEXT 7368 3568 Left 4 !;.fourier 10000 V(Fourier_L)
TEXT 7368 3640 Left 4 !;.fourier 10000 V(Fourier_R)
TEXT 7368 3712 Left 4 !;.tran 0 30.5m 30m 0.5u
TEXT 7352 3408 Left 6 ;10kHz a 600W
TEXT 6768 3392 Left 4 ;Pot Alimentacion
TEXT 6600 3360 Left 4 ;Rend =
TEXT 4880 3064 Left 4 !.param Vin 0.5
TEXT 4880 3136 Left 4 !.param Freq 1k
TEXT 8448 3648 Left 4 !;.param Vin 0
TEXT 8448 3720 Left 4 !;.param Freq 1k
TEXT 8472 2792 Left 4 !;.param Vin 0
TEXT 8472 2872 Left 4 !;.param Freq 1k
TEXT 6712 2784 Left 4 !;.param Vin 0.5
TEXT 6712 2856 Left 4 !;.param Freq 1k
TEXT 4688 3544 Left 4 ;Cambiar parámetros Vin y Freq a gusto.
TEXT 5600 3680 Left 4 ;Cambiar parámetros Vin y Freq a gusto.
TEXT 7376 3216 Left 4 !;.param Vin 0.5
TEXT 7376 3288 Left 4 !;.param Freq 1k
TEXT 7368 3776 Left 4 !;.param Vin 0.32
TEXT 7368 3848 Left 4 !;.param Freq 10k
TEXT 6704 3672 Left 3 !;.tran 0 50m 45m 1u
TEXT 6736 3720 Left 3 !;.param Vin 0.5
TEXT 6728 3768 Left 3 !;.param Freq 1k
LINE Normal 7488 4848 7120 4848 2
LINE Normal 7488 5280 7488 4848 2
LINE Normal 7120 4368 7120 4848 2
LINE Normal 8000 4368 7120 4368 2
LINE Normal 8000 5296 8000 4368 2
LINE Normal 7488 5296 8000 5296 2
LINE Normal 7488 5296 7488 5280 2
LINE Normal 8016 4752 8016 4512 2
LINE Normal 8272 4752 8016 4752 2
LINE Normal 8272 4512 8272 4752 2
LINE Normal 8016 4512 8272 4512 2
LINE Normal 4672 5984 6240 5984 2
LINE Normal 4672 4976 4672 5984 2
LINE Normal 4704 4976 4672 4976 2
LINE Normal 4672 4976 4672 5984 2
LINE Normal 10832 5984 10832 4976 2
LINE Normal 9248 5984 10832 5984 2
LINE Normal 8272 4752 8016 4752 2
LINE Normal 9584 4976 9584 5088 2
LINE Normal 10832 4976 9584 4976 2
LINE Normal 10832 5984 10832 4976 2
LINE Normal 9248 5984 10832 5984 2
LINE Normal 9248 5088 9248 5984 2
LINE Normal 8848 4864 8848 5328 2
LINE Normal 9136 4864 8848 4864 2
LINE Normal 9136 4512 9136 4864 2
LINE Normal 9584 4512 9136 4512 2
LINE Normal 9584 5088 9584 4512 2
LINE Normal 9168 5088 9584 5088 2
LINE Normal 9168 5328 9168 5088 2
LINE Normal 8848 5328 9168 5328 2
LINE Normal 5856 5104 5856 4976 2
LINE Normal 6240 5104 5856 5104 2
LINE Normal 5856 4976 4704 4976 2
LINE Normal 5856 5104 5856 4976 2
LINE Normal 6240 5104 5856 5104 2
LINE Normal 6240 5984 6240 5104 2
LINE Normal 6352 5040 5888 5040 2
LINE Normal 6352 5344 6352 5040 2
LINE Normal 6720 5344 6352 5344 2
LINE Normal 6720 4864 6720 5344 2
LINE Normal 6128 4864 6720 4864 2
LINE Normal 6112 4864 6128 4864 2
LINE Normal 6112 4512 6112 4864 2
LINE Normal 5872 4512 6112 4512 2
LINE Normal 5872 5040 5872 4512 2
LINE Normal 5872 5040 5888 5040 2
LINE Normal 9568 5232 9248 5232 2
LINE Normal 9568 5600 9568 5232 2
LINE Normal 9248 5600 9568 5600 2
LINE Normal 5904 5232 6240 5232 2
LINE Normal 5904 5600 5904 5232 2
LINE Normal 6240 5600 5904 5600 2
LINE Normal 7808 2368 7808 2368 2
LINE Normal 7760 2336 7760 2336
LINE Normal 5552 2368 5552 3920
LINE Normal 6432 2368 6432 3920
LINE Normal 7312 2368 7312 3920
LINE Normal 8192 2368 8192 3920
LINE Normal 9072 2368 9072 3920
LINE Normal 9952 2368 9952 3920
LINE Normal 6256 5728 6416 5728 3
LINE Normal 6256 6144 6256 5728 3
LINE Normal 6416 6144 6256 6144 3
LINE Normal 6416 5728 6416 6144 3
LINE Normal 9072 6144 9072 5728 3
LINE Normal 9232 6144 9072 6144 3
LINE Normal 9232 5728 9232 6144 3
LINE Normal 9072 5728 9232 5728 3
LINE Normal 7312 3136 6432 3136
LINE Normal 9072 3136 8192 3136
LINE Normal 7104 3360 6752 3360
LINE Normal 9952 3136 9072 3136
LINE Normal 10832 3136 9952 3136
RECTANGLE Normal 5792 4848 4992 4336 2
RECTANGLE Normal 9056 5984 6432 5360 2
RECTANGLE Normal 10832 3920 4656 2368
CIRCLE Normal 7920 4304 7616 4016 2

The netlist it stands for:
* V12.asc
V2 +60V 0 60
V3 0 -60V 60
Q22 +60V N015 N019 0 2N5550
Q23 +60V N019 N021 0 Qmj21194
Q24 +60V N021 N028 0 Qmj21194
Q25 +60V N021 N029 0 Qmj21194
Q26 +60V N021 N030 0 Qmj21194
Q28 -60V N039 N077 0 2N5401
Q30 -60V N077 N067 0 Qmj21193
Q31 -60V N067 N052 0 Qmj21193
Q32 -60V N067 N053 0 Qmj21193
Q33 -60V N067 N054 0 Qmj21193
R6 N030 Load_R 0.1
R18 Load_R N054 0.1
R96 N029 Load_R 0.1
R97 N028 Load_R 0.1
R98 Load_R N053 0.1
R99 Load_R N052 0.1
R100 N021 N067 180
R101 N019 N077 330
Q63 N035 N037 N039 0 BC547C
R102 N015 P001 1k5
R103 N037 N039 300
R104 N015 N035 1k
Q64 N039 N035 N015 0 BC857C
Q65 N001 N003 N005 0 BC547C
Q66 N002 N004 N006 0 BC547C
R105 +15V N001 2020
R106 +15V N002 2020
R107 N008 N005 500
R108 N006 N008 500
R114 N039 -60V 25k
Q67 N015 Current N010 0 2N5401
R115 Current 0 3k3
D11 N007 Current 1N4148
D12 +60V N007 1N4148
R116 +60V N010 100
Q68 +60V N021 N031 0 Qmj21194
Q69 +60V N021 N032 0 Qmj21194
Q70 -60V N067 N055 0 Qmj21193
Q71 -60V N067 N056 0 Qmj21193
R117 N032 Load_R 0.1
R118 Load_R N056 0.1
R119 N031 Load_R 0.1
R120 Load_R N055 0.1
Q72 +60V N021 N033 0 Qmj21194
Q73 -60V N067 N057 0 Qmj21193
R128 N033 Load_R 0.1
R129 Load_R N057 0.1
R134 +60V N065 24k
R135 N065 -60V 390
Q78 N039 N065 N075 0 QTIP41C
R136 N075 -60V 120
Q79 N039 Current N016 0 2SA1579
R139 +60V N016 100
C16 N039 N045 1.2n Rser=0.1
Q80 +60V N014 N017 0 2N5550
Q81 +60V N017 N020 0 Qmj21194
Q82 +60V N020 N027 0 Qmj21194
Q83 +60V N020 N026 0 Qmj21194
Q84 +60V N020 N025 0 Qmj21194
Q85 -60V N038 N076 0 2N5401
Q86 -60V N076 N066 0 Qmj21193
Q87 -60V N066 N051 0 Qmj21193
Q88 -60V N066 N050 0 Qmj21193
Q89 -60V N066 N049 0 Qmj21193
R140 N025 Load_L 0.1
R141 Load_L N049 0.1
R142 N026 Load_L 0.1
R143 N027 Load_L 0.1
R144 Load_L N050 0.1
R145 Load_L N051 0.1
R146 N020 N066 180
R147 N017 N076 330
Q90 N034 N036 N038 0 BC547C
R148 N014 P002 1k5
R149 N036 N038 300
R150 N014 N034 1k
Q91 N038 N034 N014 0 BC857C
R151 N038 -60V 25k
Q92 N014 Current N009 0 2N5401
R153 +60V N009 100
Q93 +60V N020 N024 0 Qmj21194
Q94 +60V N020 N023 0 Qmj21194
Q95 -60V N066 N048 0 Qmj21193
Q96 -60V N066 N047 0 Qmj21193
R154 N023 Load_L 0.1
R155 Load_L N047 0.1
R156 N024 Load_L 0.1
R157 Load_L N048 0.1
Q97 +60V N020 N022 0 Qmj21194
Q98 -60V N066 N046 0 Qmj21193
R158 N022 Load_L 0.1
R159 Load_L N046 0.1
R164 +60V N058 24k
R165 N058 -60V 390
Q103 N038 N058 N068 0 QTIP41C
R166 N068 -60V 120
Q104 N038 Current N018 0 2SA1579
C17 N038 N040 1.2n Rser=0.1
V4 Vin 0 SINE(0 {Vin} {Freq}) AC 0.5
C21 N003 Vin 156n Rser=0.1
R173 N003 0 51k
R_LOAD Load_R Load_L 8
D1 0 +15V BZX84C15VL
D2 -15V 0 BZX84C15VL
D19 N013 -15V 1N4148
D20 N011 N013 1N4148
Q9 N008 N011 N012 0 BC547C
R30 N012 -15V 68
R31 +15V N011 5700
R8 +60V N062 24k
R9 N062 -60V 390
Q1 N043 N062 N072 0 2N5550
R10 N072 -60V 120
R14 +60V N063 24k
R15 N063 -60V 390
Q3 N044 N063 N073 0 2N5550
R16 N073 -60V 120
R32 +60V N064 24k
R33 N064 -60V 390
Q10 N045 N064 N074 0 2N5550
R34 N074 -60V 120
R42 Load_R N004 470k
R43 0 N004 3k9
R11 +60V N043 5900
R17 +60V N044 5900
R19 +60V N045 5900
R28 +60V N018 100
C13 N044 N045 12n Rser=0.1
C8 N045 N065 100µ Rser=0.1
C15 N058 N040 100µ Rser=0.1
C9 N062 N002 1µ
C10 N063 N043 10µ
C12 N064 N044 15µ
R29 +60V N061 24k
R35 N061 -60V 390
Q2 N042 N061 N071 0 2N5550
R36 N071 -60V 120
R40 +60V N060 24k
R41 N060 -60V 390
Q4 N041 N060 N070 0 2N5550
R44 N070 -60V 120
R45 +60V N059 24k
R46 N059 -60V 390
Q6 N040 N059 N069 0 2N5550
R47 N069 -60V 120
R48 +60V N042 5900
R49 +60V N041 5900
R50 +60V N040 5900
C4 N041 N040 12n Rser=0.1
C5 N061 N001 1µ
C7 N060 N042 10µ
C11 N059 N041 15µ
R12 +60V N018 330
R20 +60V N016 330
R§TRIM4 P002 N036 150
R§TRIM3 P001 N037 150
J1 N039 -60V P003 LSK489B
R13 P003 P004 56
R§TRIM5 P004 -60V 9.4
J2 N038 -60V P005 LSK489B
R21 P005 P006 56
R§TRIM6 P006 -60V 7
R1 -60V -15V 2k2
R2 +60V +15V 2k2
C1 N040 N038 100p
C2 N039 N045 100p
.model D D
.lib standard.dio
.model NPN NPN
.model PNP PNP
.lib standard.bjt
.model NJF NJF
.model PJF PJF
.lib standard.jft
.inc 'TIP41C.LIB'
.inc 'MJ21194.LIB'
.inc 'MJ21193.LIB'
.inc 'BZX84C15VL.LIB'
;.tran 0 50m 45m 1u
;.ac dec 1000 1 1giga
;.fourier 1000 V(Load_L, Load_R)
;.fourier 1000 V(Load_L)
;.fourier 1000 V(Load_R)
* Voltage Source
* Voltage Amplifier Stage
* Input Stage
* Feedback
* Output Stage
* Output Stage
* Load
* Load DC
* Current Source
* Current Source
* Bias Generator
* Bias Generator
* Tiempo
* Offset
* Load DC
* Offset
* Frecuencia
* Potencia
* THD
* Continua en Reposo
* Includes
* Continua en Reposo
* Carga
* Transistores Salida
* Para ver la distorsión armónica total
* descomentar los siguientes parámetros
* Luego, ir a View -> Spice error log.
* Fourier_L refiere a la tensión en el borne
* izquierdo de la carga, Fourier_R al derecho
* Fourier_L, Fourier_R a la tensión diferencial
* Para ver la potencia disipada,
* descomentar los siguientes parámetros
;.tran 0 50m 40m 0.5u ;50m 40m 0.5u
* Luego, hacer doble click sobre el elemento
* que se desee medir manteniendo
* Para ver la respuesta en frecuencia
* descomentar el siguiente parámetro
* Luego, mantener presionado el click
* sobre un borne de la carga y soltar
* sobre el otro borne de la carga.
* Finalmente, hacer click derecho sobre
* el nombre de la curva, y dividir por el
* nombre de la tensión de entrada.
;.tran 0 50m 45m 1e-6
* Para ver el nivel de continua sobre la
* carga descomentar los siguientes parámetros
* Luego, mantener presionado el click
* sobre un borne de la carga y soltar
* sobre el otro borne de la carga.
;.tran 0 50m 45m 1e-6
* Para ver el nivel de continua sobre los
* transistores de salida, descomentar
* Luego, hacer doble click sobre el
* colector del transistor que se desee medir
* los siguientes parámetros
.tran 0 30m 25m 1u
* Para ver la señal en tiempo, descomentar
* el siguiente parámetro
* Luego, mantener presionado el click
* sobre un borne de la carga y soltar
* sobre el otro borne de la carga.
* Rendimiento
* presionada la tecla ALT.
* Trimmer
* Trimmer 10Ohm
* Trimmer 10Ohm
* 500Ohm
* Trimmer
* 500Ohm
* Analisis con Ruido
* Para ver los efectos de ruido
* Se introduce en serie a la entrada
* una fuente en modo PWL File
* Esta es la funcion que se debe
* PWL file=noise50mv1seg.pwl
* Zin
* Se debe reproducir la siguiente directiva
;.ac dec 1000 1 100meg
* Y medir la tensión de entrada sobre la
* corriente de entrada
* Se debe poner la entrada a masa
;.ac dec 1000 1 100meg
* Y medir la tensión de entrada sobre la
* corriente de entrada
* Zout
* Y una fuente en lugar de la carga luego
* Se debe reproducir la siguiente directiva
;.meas Pout AVG V(Fourier_R,Fourier_L)*I(R172)
;.meas Pin AVG -((V(+60V)*I(V2))-(V(-60V)*I(V3)))
;.meas Rend PARAM Pout/Pin
* Para ver el rendimiento calculado como
* Pot Carga
* descomentar los siguientes parámetros
* Luego, ir a View->Spice error log
* y buscar el parámetro "Rend" calculado
* ingresar a la fuente. (Ruido blanco
* con distribución uniforme de 50mV)
* 1kHz a pot maxima
;.fourier 10000 V(Fourier_L, Fourier_R)
;.fourier 10000 V(Fourier_L)
;.fourier 10000 V(Fourier_R)
;.tran 0 30.5m 30m 0.5u
* 10kHz a 600W
* Pot Alimentacion
* Rend =
.param Vin 0.5
.param Freq 1k
;.param Vin 0
;.param Freq 1k
;.param Vin 0
;.param Freq 1k
;.param Vin 0.5
;.param Freq 1k
* Cambiar parámetros Vin y Freq a gusto.
* Cambiar parámetros Vin y Freq a gusto.
;.param Vin 0.5
;.param Freq 1k
;.param Vin 0.32
;.param Freq 10k
;.tran 0 50m 45m 1u
;.param Vin 0.5
;.param Freq 1k
.backanno
.end